# Altium schematic sheet Ring 3_C.SchDoc
size A; DocumentNumber: 10; SheetNumber: 16; SheetTotal: 30
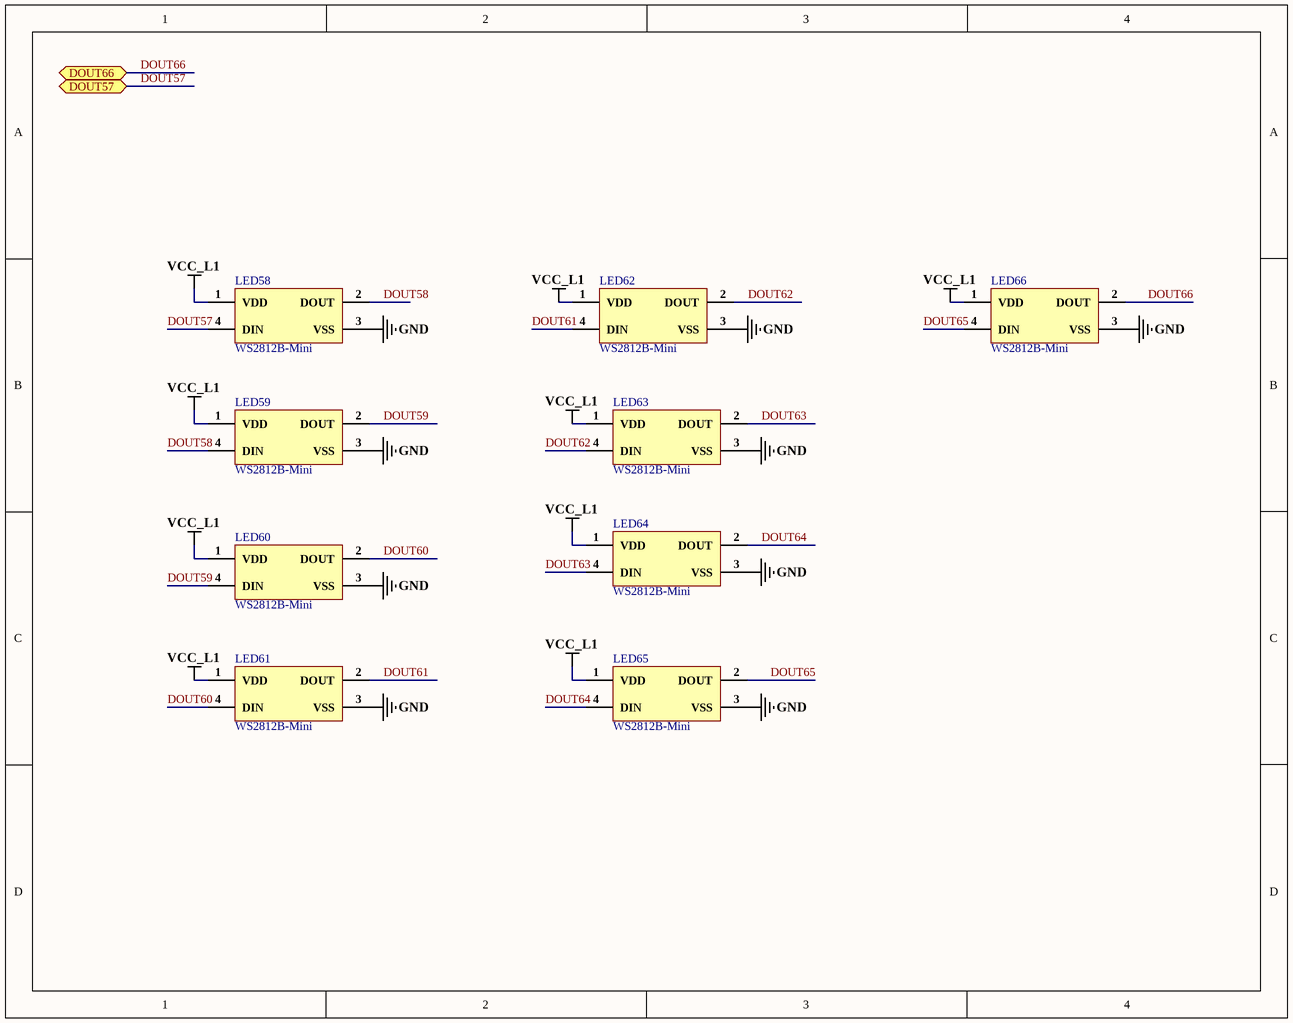
[diagram p0: Ring 3_C.SchDoc]

## Parts
LED58  WS2812B-Mini  [WS2812B-Mini]
LED59  WS2812B-Mini  [WS2812B-Mini]
LED60  WS2812B-Mini  [WS2812B-Mini]
LED61  WS2812B-Mini  [WS2812B-Mini]
LED62  WS2812B-Mini  [WS2812B-Mini]
LED63  WS2812B-Mini  [WS2812B-Mini]
LED64  WS2812B-Mini  [WS2812B-Mini]
LED65  WS2812B-Mini  [WS2812B-Mini]
LED66  WS2812B-Mini  [WS2812B-Mini]

## Ports
DOUT57 (bidir), DOUT66 (bidir)

## Nets
GND: LED58.3(VSS) LED59.3(VSS) LED60.3(VSS) LED61.3(VSS) LED62.3(VSS) LED63.3(VSS) LED64.3(VSS) LED65.3(VSS) LED66.3(VSS)
VCC_L1: LED58.1(VDD) LED59.1(VDD) LED60.1(VDD) LED61.1(VDD) LED62.1(VDD) LED63.1(VDD) LED64.1(VDD) LED65.1(VDD) LED66.1(VDD)
DOUT57: LED58.4(DIN) ; port DOUT57
DOUT58: LED58.2(DOUT) LED59.4(DIN)
DOUT59: LED59.2(DOUT) LED60.4(DIN)
DOUT60: LED60.2(DOUT) LED61.4(DIN)
DOUT61: LED61.2(DOUT) LED62.4(DIN)
DOUT62: LED62.2(DOUT) LED63.4(DIN)
DOUT63: LED63.2(DOUT) LED64.4(DIN)
DOUT64: LED64.2(DOUT) LED65.4(DIN)
DOUT65: LED65.2(DOUT) LED66.4(DIN)
DOUT66: LED66.2(DOUT) ; port DOUT66

## Library data of the parts
LED58-LED66 = WS2812B-Mini: SMD,3.5x3.5mm Light Emitting Diodes (LED) RoHS; Manufacturer: Worldsemi; ComponentLink1Description: LCSC; ComponentLink1URL: *https://lcsc.com/product-detail/Light-Emitting-Diodes-LED_Worldsemi-WS2812B-Mini_C527089.html; Package: SMD,3.5x3.5mm; Parameter 1: *